# Altium project PCB_Project_4.PrjPcb
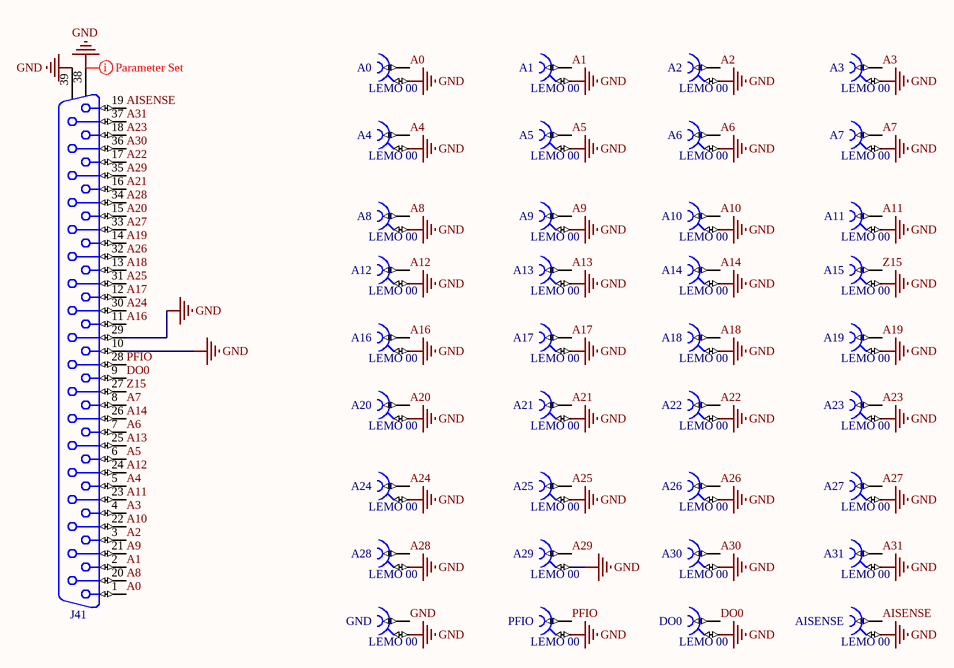
[diagram p0: Sheet1.SchDoc]
1 sheet, 37 parts. Net scope: global (net labels, ports and power ports of the same name join across sheets).
Board file: PCB1.PcbDoc

## Sheet Sheet1.SchDoc
size A4

### Parts
A0  LEMO 00  [LEMO_EPA.00.250.NTN]
A1  LEMO 00  [LEMO_EPA.00.250.NTN]
A2  LEMO 00  [LEMO_EPA.00.250.NTN]
A3  LEMO 00  [LEMO_EPA.00.250.NTN]
A4  LEMO 00  [LEMO_EPA.00.250.NTN]
A5  LEMO 00  [LEMO_EPA.00.250.NTN]
A6  LEMO 00  [LEMO_EPA.00.250.NTN]
A7  LEMO 00  [LEMO_EPA.00.250.NTN]
A8  LEMO 00  [LEMO_EPA.00.250.NTN]
A9  LEMO 00  [LEMO_EPA.00.250.NTN]
A10  LEMO 00  [LEMO_EPA.00.250.NTN]
A11  LEMO 00  [LEMO_EPA.00.250.NTN]
A12  LEMO 00  [LEMO_EPA.00.250.NTN]
A13  LEMO 00  [LEMO_EPA.00.250.NTN]
A14  LEMO 00  [LEMO_EPA.00.250.NTN]
A15  LEMO 00  [LEMO_EPA.00.250.NTN]
A16  LEMO 00  [LEMO_EPA.00.250.NTN]
A17  LEMO 00  [LEMO_EPA.00.250.NTN]
A18  LEMO 00  [LEMO_EPA.00.250.NTN]
A19  LEMO 00  [LEMO_EPA.00.250.NTN]
A20  LEMO 00  [LEMO_EPA.00.250.NTN]
A21  LEMO 00  [LEMO_EPA.00.250.NTN]
A22  LEMO 00  [LEMO_EPA.00.250.NTN]
A23  LEMO 00  [LEMO_EPA.00.250.NTN]
A24  LEMO 00  [LEMO_EPA.00.250.NTN]
A25  LEMO 00  [LEMO_EPA.00.250.NTN]
A26  LEMO 00  [LEMO_EPA.00.250.NTN]
A27  LEMO 00  [LEMO_EPA.00.250.NTN]
A28  LEMO 00  [LEMO_EPA.00.250.NTN]
A29  LEMO 00  [LEMO_EPA.00.250.NTN]
A30  LEMO 00  [LEMO_EPA.00.250.NTN]
A31  LEMO 00  [LEMO_EPA.00.250.NTN]
AISENSE  LEMO 00  [LEMO_EPA.00.250.NTN]
DO0  LEMO 00  [LEMO_EPA.00.250.NTN]
GND  LEMO 00  [LEMO_EPA.00.250.NTN]
J41  D-SUB37F  [NORCOMP_172-037-242R011]  (value not drawn)
PFIO  LEMO 00  [LEMO_EPA.00.250.NTN]

### Nets
GND: A0.2 A1.2 A2.2 A3.2 A4.2 A5.2 A6.2 A7.2 A8.2 A9.2 A10.2 A11.2 A12.2 A13.2 A14.2 A15.2 A16.2 A17.2 A18.2 A19.2 A20.2 A21.2 A22.2 A23.2 A24.2 A25.2 A26.2 A27.2 A28.2 A29.2 A30.2 A31.2 AISENSE.2 DO0.2 GND.1 GND.2 J41.10 J41.29 J41.38 J41.39 PFIO.2
A0: A0.1 J41.1
A1: A1.1 J41.2
A2: A2.1 J41.3
A3: A3.1 J41.4
A4: A4.1 J41.5
A5: A5.1 J41.6
A6: A6.1 J41.7
A7: A7.1 J41.8
A8: A8.1 J41.20
A9: A9.1 J41.21
A10: A10.1 J41.22
A11: A11.1 J41.23
A12: A12.1 J41.24
A13: A13.1 J41.25
A14: A14.1 J41.26
A16: A16.1 J41.11
A17: A17.1 J41.12
A18: A18.1 J41.13
A19: A19.1 J41.14
A20: A20.1 J41.15
A21: A21.1 J41.16
A22: A22.1 J41.17
A23: A23.1 J41.18
A24: A24.1 J41.30
A25: A25.1 J41.31
A26: A26.1 J41.32
A27: A27.1 J41.33
A28: A28.1 J41.34
A29: A29.1 J41.35
A30: A30.1 J41.36
A31: A31.1 J41.37
AISENSE: AISENSE.1 J41.19
DO0: DO0.1 J41.9
PFIO: J41.28 PFIO.1
Z15: A15.1 J41.27

### Layout directives
rule Routing Layers [TopLayer - DisabledBottomLayer - Enabled ]: GND

### Library data of the parts
A0-A31 AISENSE DO0 GND PFIO = LEMO_EPA.00.250.NTN: Part Description: Size 00, 50 Ohms Coaxial Straight socket; PressFit: No; SCEM: 09.46.11.184.2; Part Number: LEMO_EPA.00.250.NTN; Component Kind: Standard; Component Type: Standard; Pin Count: 2; Family: LEMO 00; Mounted: Yes; Socket: No; SMD: No; Sense: No; Status: None; Manufacturer: LEMO; Manufacturer Part Number: EPA.00.250.NTN; ComponentHeight: 14mm; HelpURL: \\cern.ch\dfs\Applications\Altium\Datasheets\LEMO_EPA.00.250.NTN.pdf; Author: CERN DEM JLC; CreateDate: 22/04/2008; LatestRevisionDate: 22/04/2008
J41 = NORCOMP_172-037-242R011: Connector D-sub 37 Female; Part Description: Straight Wire Wrap D-Sub 37 Contacts Female Connector With 0.065"Clinch Nut (Board Side); PressFit: No; Part Number: NORCOMP_172-037-242R011; Component Kind: Standard; Component Type: Standard; Pin Count: 39; Family: D-SUB37F; Mounted: Yes; Socket: No; SMD: No; Sense: No; Status: None; Manufacturer: NORCOMP; Manufacturer Part Number: 172-037-242R011; ComponentHeight: 12.08mm; HelpURL: \\cern.ch\dfs\Applications\Altium\Datasheets\NORCOMP_172-037-242R011.pdf; Author: CERN DEM MR; CreateDate: 24/03/2016; LatestRevisionDate: 24/03/2016